# EAGLE schematic 3v-battery-sensor (EAGLE 7.2.0)
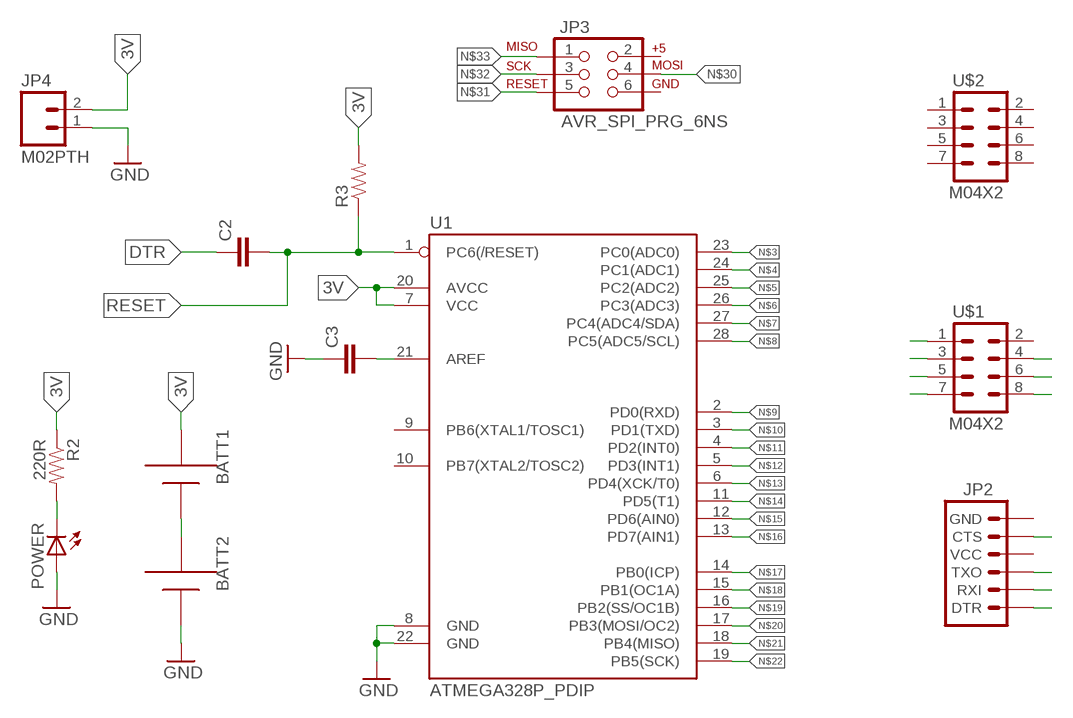
[diagram p0: schematic, sheet 1]

## Parts
BATT1  AAA  [12BH412]
BATT2  AAA  [12BH412]
C2  CAP0805  [0805]
C3  CAP0805  [0805]
JP2  ARDUINO_SERIAL_PROGRAMPTH  [1X06]
JP3  AVR_SPI_PRG_6NS  [2X3-NS]
JP4  M02PTH  [1X02]
POWER  LEDCHIPLED_0805  [CHIPLED_0805]
R2  220R  RESISTOR0805-RES  [0805]
R3  RESISTOR0805-RES  [0805]
U1  ATMEGA328P_PDIP  [DIL28-3]
U$1  M04X2  [2X4]
U$2  M04X2  [2X4]

## Nets
3V: BATT1.- JP4.2 R2.1 R3.2 U1.7(VCC) U1.20(AVCC)
DTR: C2.1
GND: BATT2.+ C3.1 JP4.1 POWER.A U1.8(GND) U1.22(GND)
N$1: POWER.C R2.2
N$2: BATT1.+ BATT2.-
N$3: U1.23(PC0(ADC0))
N$4: U1.24(PC1(ADC1))
N$5: U1.25(PC2(ADC2))
N$6: U1.26(PC3(ADC3))
N$7: U1.27(PC4(ADC4/SDA))
N$8: U1.28(PC5(ADC5/SCL))
N$9: U1.2(PD0(RXD))
N$10: U1.3(PD1(TXD))
N$11: U1.4(PD2(INT0))
N$12: U1.5(PD3(INT1))
N$13: U1.6(PD4(XCK/T0))
N$14: U1.11(PD5(T1))
N$15: U1.12(PD6(AIN0))
N$16: U1.13(PD7(AIN1))
N$17: U1.14(PB0(ICP))
N$18: U1.15(PB1(OC1A))
N$19: U1.16(PB2(SS/OC1B))
N$20: U1.17(PB3(MOSI/OC2))
N$21: U1.18(PB4(MISO))
N$22: U1.19(PB5(SCK))
N$23: C3.2 U1.21(AREF)
N$25: JP2.5(CTS)
N$27: JP2.3(TXO)
N$28: JP2.2(RXI)
N$29: JP2.1(DTR)
N$30: JP3.4
N$31: JP3.5
N$32: JP3.3
N$33: JP3.1
N$34: U$1.4
N$35: U$1.6
N$36: U$1.8
N$37: U$1.3
N$38: U$1.5
N$39: U$1.7
N$40: U$1.1
RESET: C2.2 R3.1 U1.1(PC6(/RESET))
Unconnected: JP2.4(VCC) JP2.6(GND) JP3.2 JP3.6 U1.9(PB6(XTAL1/TOSC1)) U1.10(PB7(XTAL2/TOSC2)) U$1.2 U$2.1 U$2.2 U$2.3 U$2.4 U$2.5 U$2.6 U$2.7 U$2.8

## Library data of the parts
BATT1 BATT2 = adafruit:AAA: AAA PC pin holder Mouser part #12BH412 - but pretty much any 1x AAA battery holder should be the same http://www.ladyada.net/library/pcb/eaglelibrary.html
C2 C3 = SparkFun-Capacitors:CAP: Capacitor Standard 0603 ceramic capacitor, and 0.1" leaded capacitor.
JP2 = SparkFun-Connectors:ARDUINO_SERIAL_PROGRAM: FTDI connector footprints
JP3 = SparkFun-Connectors:AVR_SPI_PRG_6: AVR ISP 6 Pin This is the reduced ISP connector for AVR programming. Common on Arduino. This footprint will take up less PCB space and can be used with a 10-pin to 6-pin adapter such as SKU: BOB-08508 **Special note about "TEST_POINT" package. The stop mask is on the top side, so if you want your programming test points to be on the bottom of your board, make sure to place this package on the bottom side of the board. This also ensure that the orientation to program from the bottom side will be correct.
JP4 = SparkFun-Connectors:M02: Standard 2-pin 0.1" header. Use with - straight break away headers ( PRT-00116) - right angle break away headers (PRT-00553) - swiss pins (PRT-00743) - machine pins (PRT-00117) - female headers (PRT-00115) Molex polarized connector foot print use with: PRT-08233 with associated crimp pins and housings. 2.54_SCREWTERM for use with PRT-10571. 3.5mm Screw Terminal footprints for PRT-08084 5mm Screw Terminal footprints for use with PRT-08432
POWER = adafruit:LED: LED OSRAM: - CHIPLED LG R971, LG N971, LY N971, LG Q971, LY Q971, LO R971, LY R971 LH N974, LH R974 LS Q976, LO Q976, LY Q976 LO Q996 - Hyper CHIPLED LW Q18S LB Q993, LB Q99A, LB R99A - SideLED LS A670, LO A670, LY A670, LG A670, LP A670 LB A673, LV A673, LT A673, LW A673 LH A674 LY A675 LS A676, LA A676, LO A676, LY A676, LW A676 LS A679, LY A679, LG A679 - Hyper Micro SIDELED® LS Y876, LA Y876, LO Y876, LY Y876 LT Y87S - SmartLED LW L88C, LW L88S LB L89C, LB L89S, LG L890 LS L89K, LO L89K, LY L89K LS L896, LA L896, LO L896, LY L896 - TOPLED LS T670, LO T670, LY T670, LG T670, LP T670 LSG T670, LSP T670, LSY T670, LOP T670, LYG T670 LG T671, LOG T671, LSG T671 LB T673, LV T673, LT T673, LW T673 LH T674 LS T676, LA T676, LO T676, LY T676, LB T676, LH T676, LSB T676, LW T676 LB T67C, LV T67C, LT T67C, LS T67K, LO T67K, LY T67K, LW E67C LS E67B, LA E67B, LO E67B, LY E67B, LB E67C, LV E67C, LT E67C LW T67C LS T679, LY T679, LG T679 LS T770, LO T770, LY T770, LG T770, LP T770 LB T773, LV T773, LT T773, LW T773 LH T774 LS E675, LA E675, LY E675, LS T675 LS T776, LA T776, LO T776, LY T776, LB T776 LHGB T686 LT T68C, LB T68C - Hyper Mini TOPLED® LB M676 - Mini TOPLED Santana® LG M470 LS M47K, LO M47K, LY M47K Source: http://www.osram.convergy.de/
R2 R3 = SparkFun-Resistors:RESISTOR: Resistor Basic schematic elements and footprints for 0603, 1206, and PTH resistors.
U1 = SparkFun-DigitalIC:ATMEGA328P_PDIP: uC used in the Arduino 32kb flash, 1k EEPROM, 2k SRAM This is the through-hole version of this chip.
U$1 U$2 = SparkFun-Connectors:M04X2: .1" header, two rows of four.